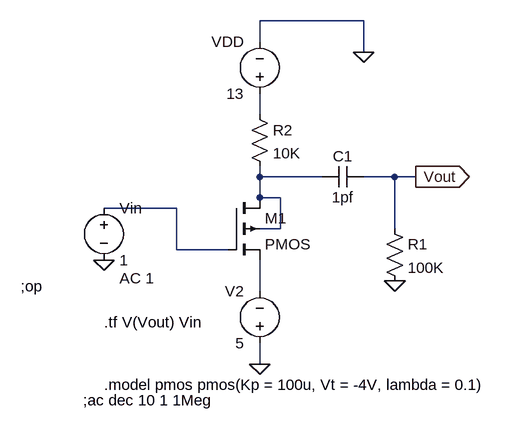
[diagram p0: schematic Exp 2.1 CS amplifier.asc]
Exp 2.1 CS amplifier.asc, the LTspice schematic file:
Version 4
SHEET 1 880 680
WIRE 320 -144 160 -144
WIRE 160 -112 160 -144
WIRE 320 -96 320 -144
WIRE 160 0 160 -32
WIRE 160 96 160 80
WIRE 256 96 160 96
WIRE 368 96 320 96
WIRE 400 96 368 96
WIRE 160 128 160 96
WIRE 192 128 160 128
WIRE 32 144 -80 144
WIRE 192 176 192 128
WIRE 192 176 160 176
WIRE 368 176 368 96
WIRE 32 208 32 144
WIRE 112 208 32 208
WIRE 160 272 160 224
WIRE 160 384 160 352
FLAG 400 96 Vout
IOPIN 400 96 Out
FLAG -80 224 0
FLAG 368 256 0
FLAG 160 384 0
FLAG 320 -96 0
SYMBOL pmos4 112 128 R0
SYMATTR InstName M1
SYMATTR Value2 l=1 w=4
SYMBOL voltage 160 -16 R180
WINDOW 0 24 96 Left 2
WINDOW 3 24 16 Left 2
WINDOW 123 0 0 Left 0
WINDOW 39 0 0 Left 0
SYMATTR InstName VDD
SYMATTR Value 13
SYMBOL voltage 160 368 R180
WINDOW 0 24 96 Left 2
WINDOW 3 24 16 Left 2
WINDOW 123 0 0 Left 0
WINDOW 39 0 0 Left 0
SYMATTR InstName V2
SYMATTR Value 5
SYMBOL voltage -80 128 R0
WINDOW 123 24 124 Left 2
WINDOW 39 0 0 Left 0
SYMATTR Value2 AC 1
SYMATTR InstName Vin
SYMATTR Value 1
SYMBOL cap 320 80 R90
WINDOW 0 0 32 VBottom 2
WINDOW 3 32 32 VTop 2
SYMATTR InstName C1
SYMATTR Value 1pf
SYMBOL res 352 160 R0
SYMATTR InstName R1
SYMATTR Value 100K
SYMBOL res 144 -16 R0
SYMATTR InstName R2
SYMATTR Value 10K
TEXT -80 416 Left 2 !.model pmos pmos(Kp = 100u, Vt = -4V, lambda = 0.1)
TEXT -112 440 Left 2 !;ac dec 10 1 1Meg
TEXT -208 264 Left 2 !;op
TEXT -80 320 Left 2 !.tf V(Vout) Vin

The netlist it stands for:
* Exp 2.1 CS amplifier.asc
M1 N002 N003 N004 N002 PMOS l=1 w=4
VDD N001 0 13
V2 0 N004 5
Vin N003 0 1 AC 1
C1 Vout N002 1pf
R1 Vout 0 100K
R2 N001 N002 10K
.model NMOS NMOS
.model PMOS PMOS
.lib standard.mos
.model pmos pmos(Kp = 100u, Vt = -4V, lambda = 0.1)
;ac dec 10 1 1Meg
;op
.tf V(Vout) Vin
.backanno
.end